# Altium schematic sheet EEPROM.SchDoc
size A; SheetNumber: 5; SheetTotal: 11
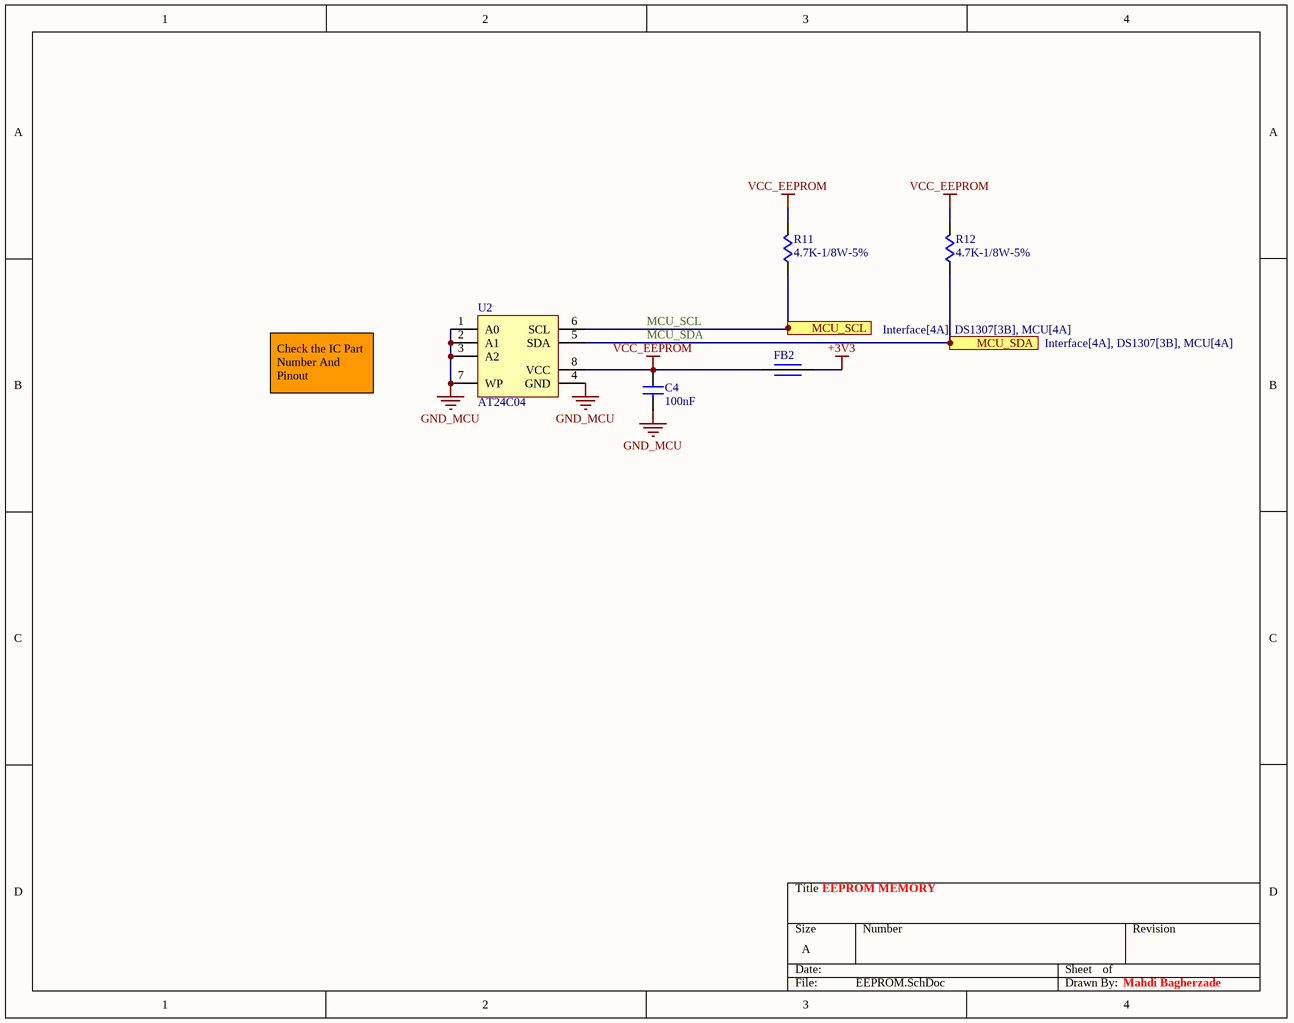
[diagram p0: EEPROM.SchDoc]

## Parts
C4  value 100nF  [C-0805]  (hidden comment: CAP Cer 100nF-50V-X7R-SMD)
FB2  FERRITE BEAD  [FB-0805]  (value not drawn)
R11  4.7K-1/8W-5%  [R-0805]
R12  4.7K-1/8W-5%  [R-0805]
U2  AT24C04  [SOIC8]

## Ports
MCU_SCL (see Interface[4A], DS1307[3B], MCU[4A]), MCU_SDA (see Interface[4A], DS1307[3B], MCU[4A])

## Nets
+3V3: FB2.2
GND_MCU: C4.2 U2.1(A0) U2.2(A1) U2.3(A2) U2.4(GND) U2.7(WP)
VCC_EEPROM: C4.1 FB2.1 R11.2 R12.2 U2.8(VCC)
MCU_SCL: R11.1 U2.6(SCL) ; port MCU_SCL
MCU_SDA: R12.1 U2.5(SDA) ; port MCU_SDA

## Notes on the sheet
- Check the IC Part Number And Pinout
- EEPROM MEMORY
- Mahdi Bagherzade

## Library data of the parts
C4 = CAP-CER: CAPACITOR; Phone Number: 0915 8700 314; Voltage: 50V; Tolerance: X7R; Type: SMD; Publisher: Mahdi Bagherzadeh; ComponentLink1Description: Linkedin; ComponentLink1URL: https://ir.linkedin.com/in/mahdi-bagherzade; Published Date: 9-15-2024
FB2 = FERRITE BEAD: INDUCATOR; Phone Number: 0915 8700 314; Publisher: Mahdi Bagherzadeh; ComponentLink1Description: Linkedin; ComponentLink1URL: https://ir.linkedin.com/in/mahdi-bagherzade; Published Date: 9-15-2024
R11 R12 = RES: RESISTOR; Phone Number: 0915 8700 314; Publisher: Mahdi Bagherzadeh; ComponentLink1Description: Linkedin; ComponentLink1URL: https://ir.linkedin.com/in/mahdi-bagherzade; Published Date: 9-15-2024
U2 = AT24C04: IC; Phone Number: 0915 8700 314; Publisher: Mahdi Bagherzadeh; ComponentLink1Description: Linkedin; ComponentLink1URL: https://ir.linkedin.com/in/mahdi-bagherzade; Published Date: 9-15-2024